# EAGLE design PlytaGlowna (EAGLE 8.6.0)
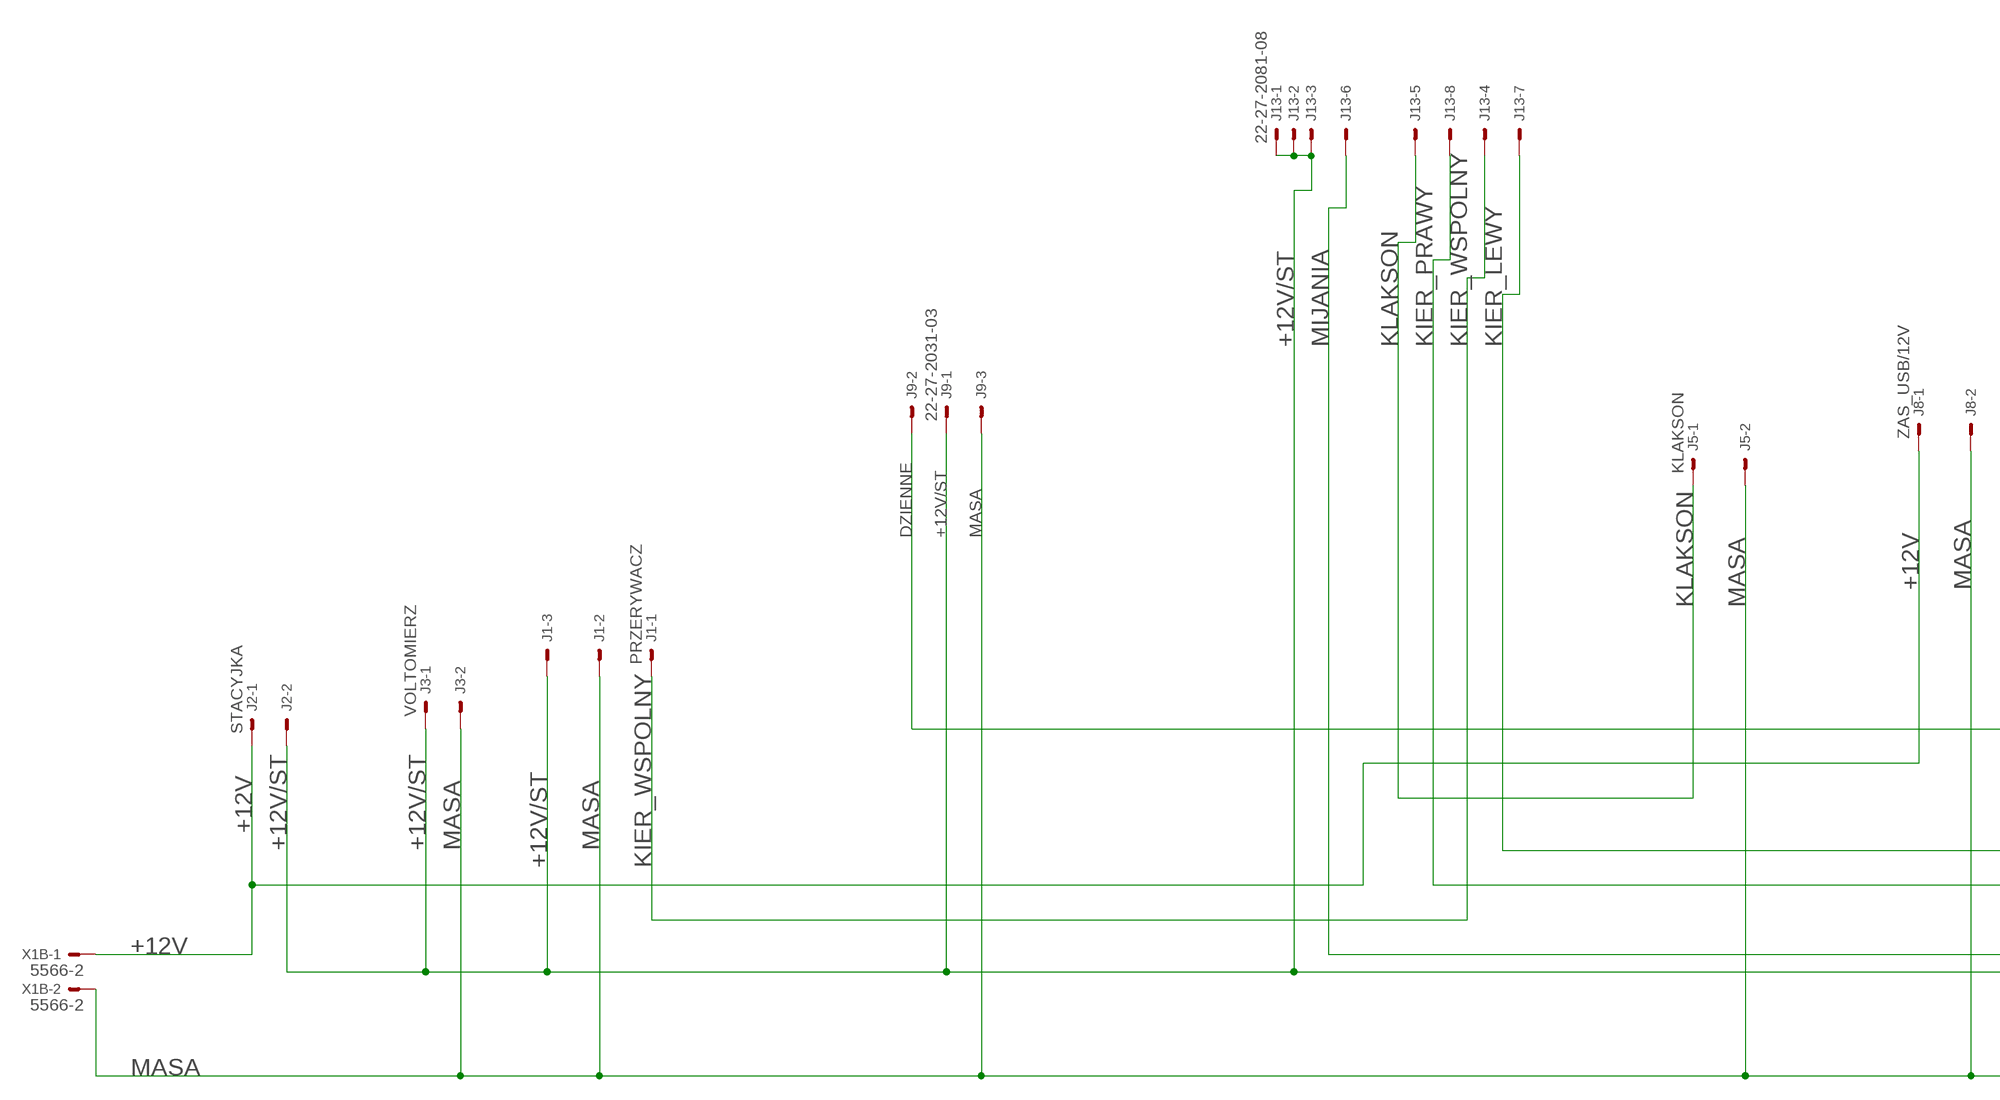
[diagram p0: schematic, sheet 1, part 1 of 2]
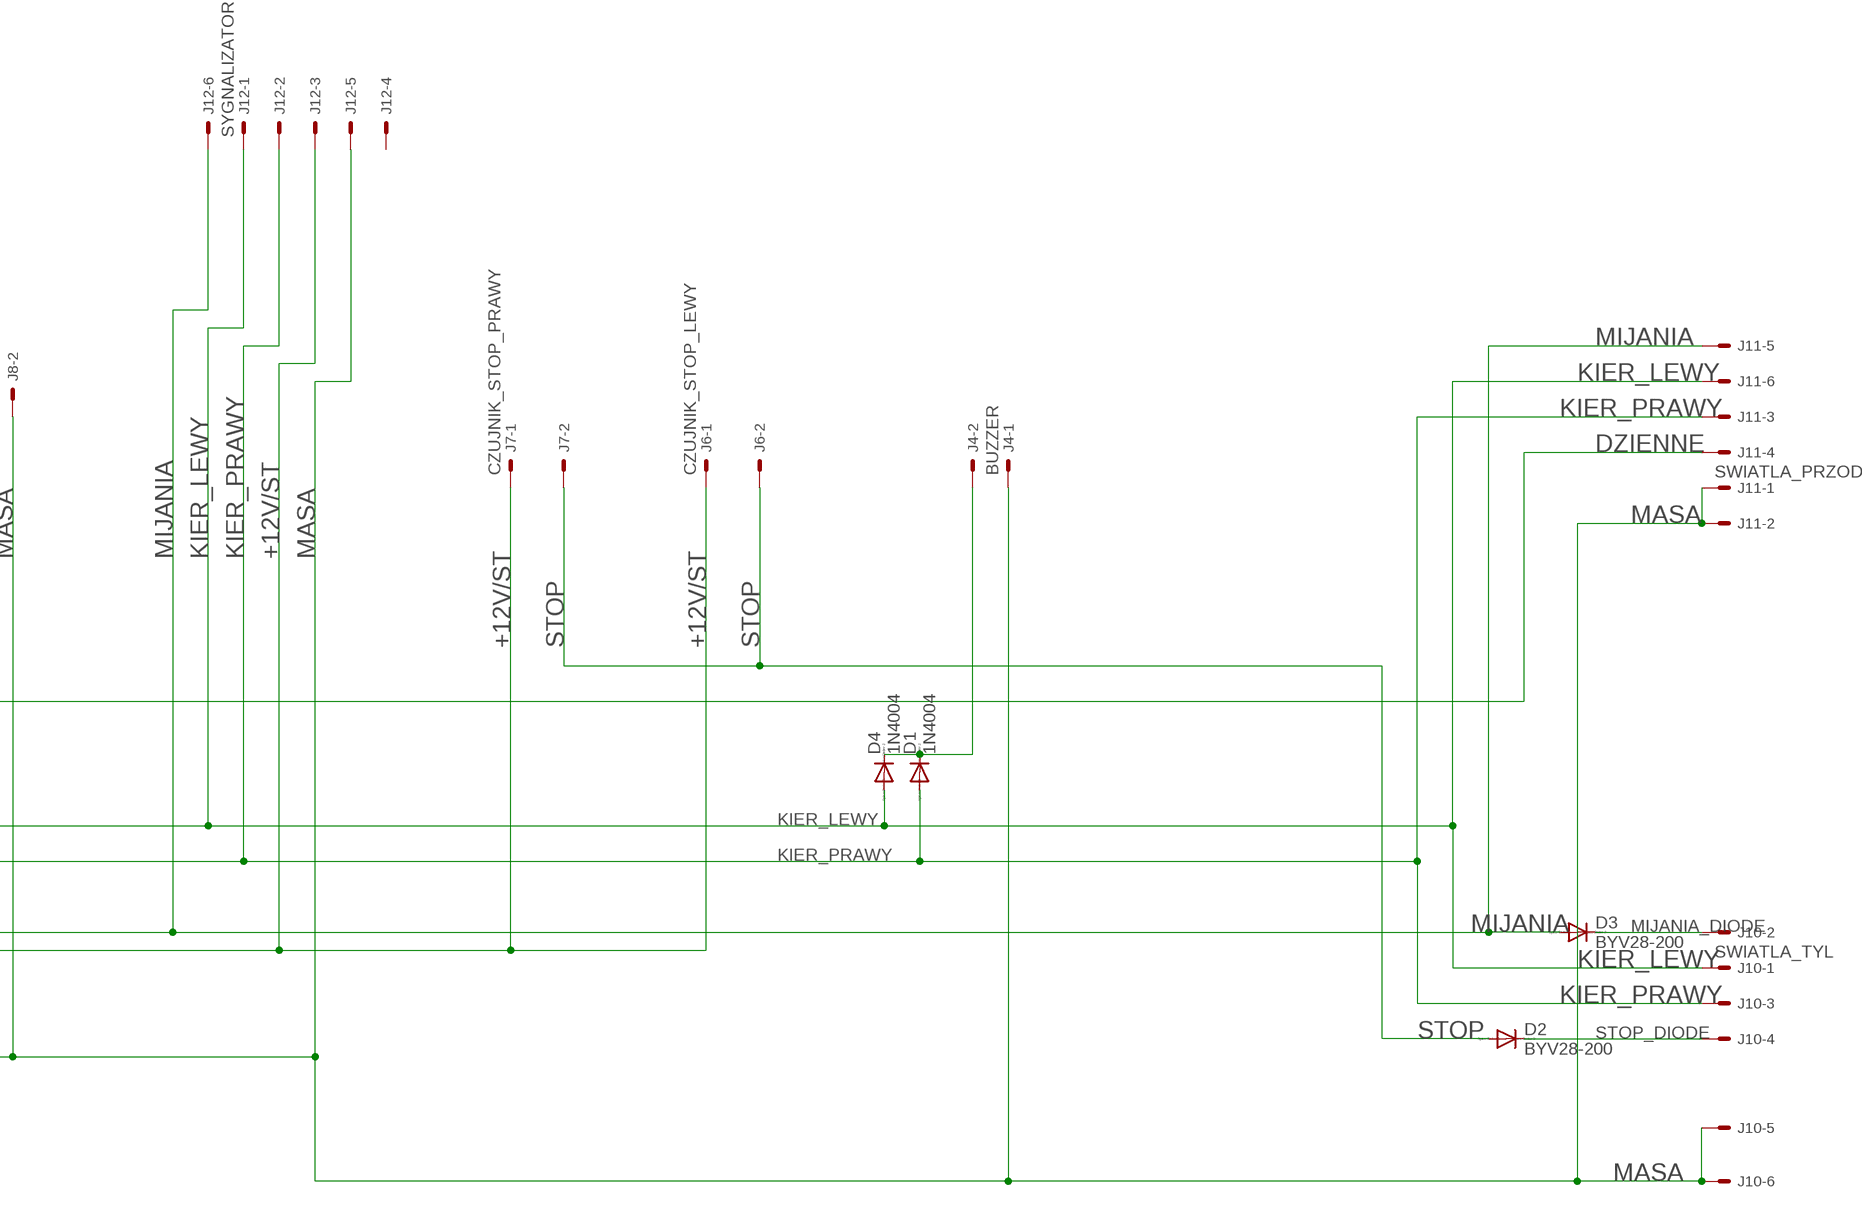
[diagram p1: schematic, sheet 1, part 2 of 2]

## Parts
D1  1N4004  [DO41-10]
D2  BYV28-200  BYV28  [SOD64-10]
D3  BYV28-200  BYV28  [SOD64-10]
D4  1N4004  [DO41-10]
J1  PRZERYWACZ  22-27-2031-03  [6410-03]
J2  STACYJKA  22-27-2021-02  [6410-02]
J3  VOLTOMIERZ  22-27-2021-02  [6410-02]
J4  BUZZER  22-27-2021-02  [6410-02]
J5  KLAKSON  22-27-2021-02  [6410-02]
J6  CZUJNIK_STOP_LEWY  22-27-2021-02  [6410-02]
J7  CZUJNIK_STOP_PRAWY  22-27-2021-02  [6410-02]
J8  ZAS_USB/12V  22-27-2021-02  [6410-02]
J9  22-27-2031-03  [6410-03]
J10  SWIATLA_TYL  22-27-2061-06  [6410-06]
J11  SWIATLA_PRZOD  22-27-2061-06  [6410-06]
J12  SYGNALIZATOR  22-27-2061-06  [6410-06]
J13  22-27-2081-08  [6410-08]
X1B  5566-2  [5566-2]

## Nets
+12V: J2.1 J8.1 X1B.1
+12V/ST: J1.3 J2.2 J3.1 J6.1 J7.1 J9.1 J12.3 J13.1 J13.2 J13.3
DZIENNE: J9.2 J11.4
KIER_LEWY: D4.A J10.1 J11.6 J12.1 J13.7
KIER_PRAWY: D1.A J10.3 J11.3 J12.2 J13.8
KIER_WSPOLNY: J1.1 J13.4
KLAKSON: J5.1 J13.5
MASA: J1.2 J3.2 J4.1 J5.2 J8.2 J9.3 J10.5 J10.6 J11.1 J11.2 J12.5 X1B.2
MIJANIA: D3.A J11.5 J12.6 J13.6
MIJANIA_DIODE: D3.C J10.2
N$1: D1.C D4.C J4.2
STOP: D2.A J6.2 J7.2
STOP_DIODE: D2.C J10.4
Unconnected: J12.4

## Library data of the parts
D1 D4 = diode:1N4004: DIODE general purpose rectifier, 1 A
D2 D3 = diode:BYV28: DIODE ultra fast
J1 J9 = con-molex:22-?-03: CONNECTOR wire to board 2.54 mm (.1 inch) pitch header; MF: MOLEX; OC_FARNELL: unknown; OC_NEWARK: unknown
J2-J8 = con-molex:22-?-02: CONNECTOR wire to board 2.54 mm (.1 inch) pitch header; MF: MOLEX; OC_FARNELL: unknown; OC_NEWARK: unknown
J10-J12 = con-molex:22-?-06: CONNECTOR wire to board 2.54 mm (.1 inch) pitch header; MF: MOLEX; OC_FARNELL: unknown; OC_NEWARK: unknown
J13 = con-molex:22-?-08: CONNECTOR wire to board 2.54 mm (.1 inch) pitch header; MF: MOLEX; OC_FARNELL: unknown; OC_NEWARK: unknown
X1B = con-molex:5566-2: Mini FIT connector 2 pol Source: http://www.molex.com; OC_FARNELL: 1822072; OC_NEWARK: unknown

## Board
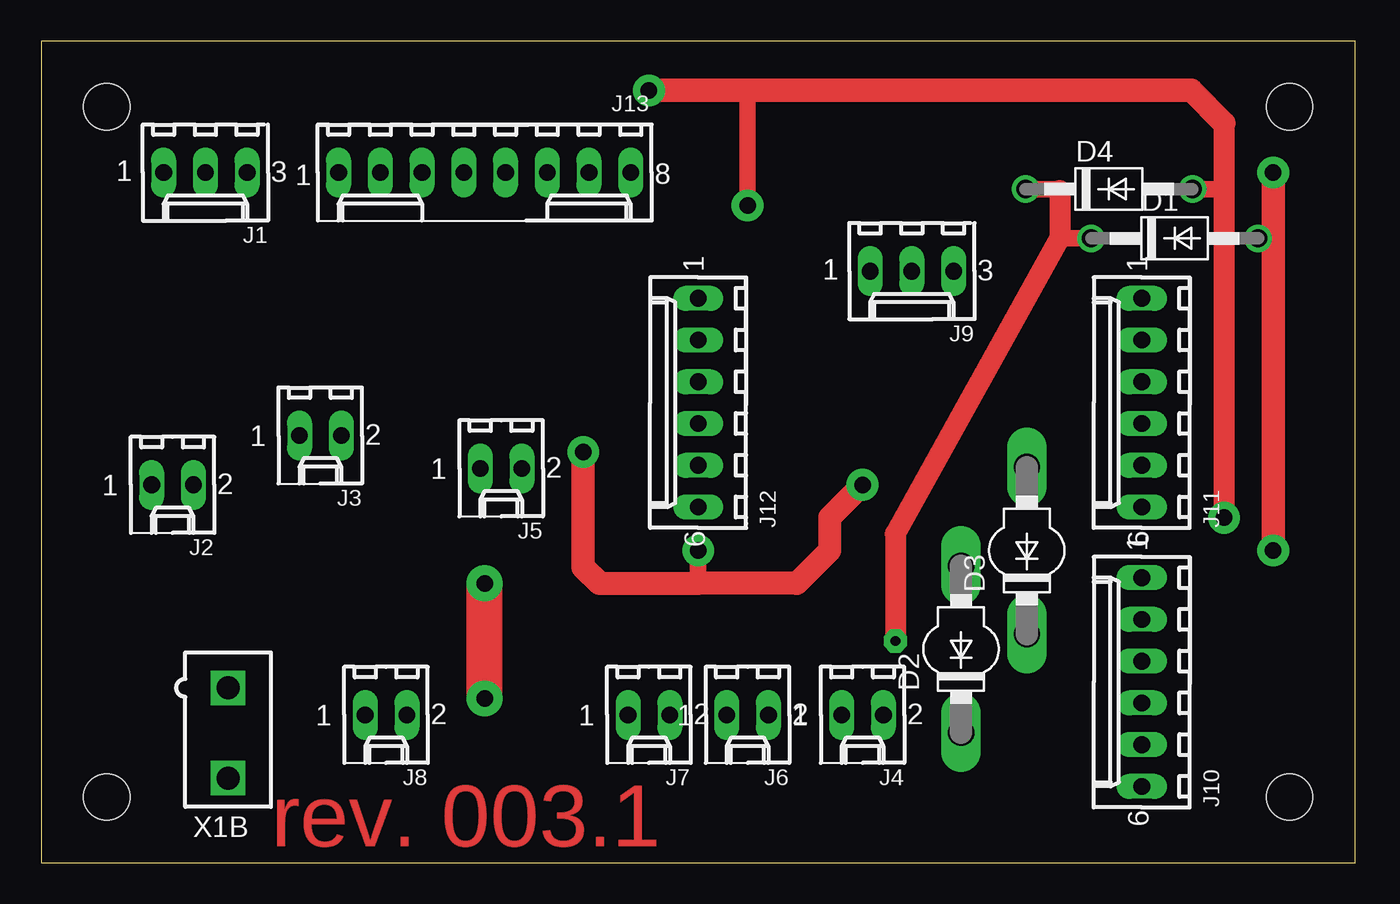
[diagram p2: board, top side]
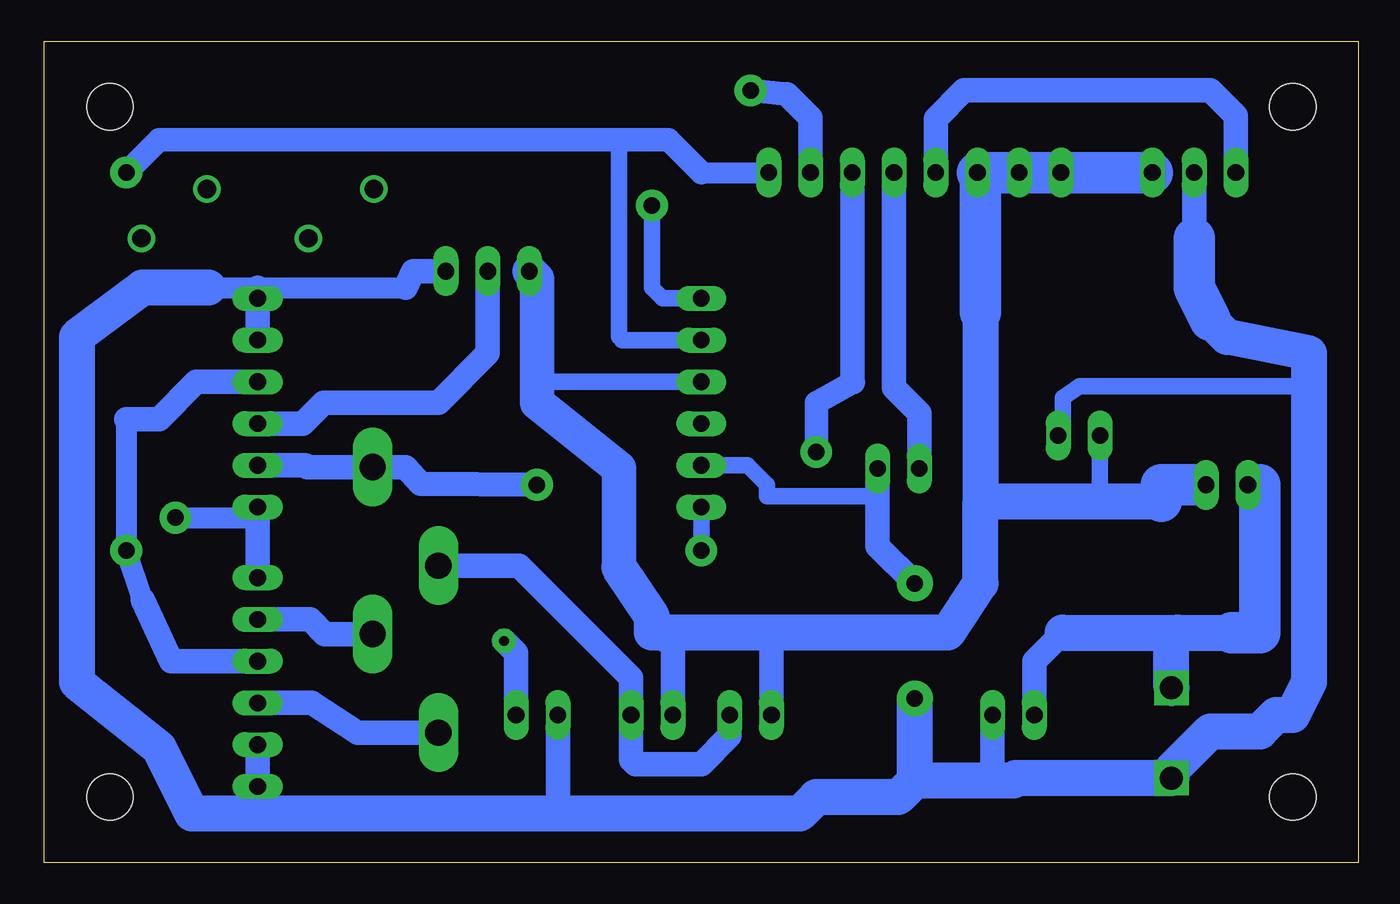
[diagram p3: board, bottom side, seen from below]

Size 80 x 50 mm. Coordinates in mm from the lower left corner, seen from the top.
Outline: 0,0 80,0 80,50 0,50 0,0
Copper layers (1*16): Top 0.035mm / dielectric 1.5mm / Bottom 0.035mm
Design rules "default": minimum track width 10mil, minimum drill 24mil, track to track 8mil, track to pad 8mil, pad to pad 8mil, via to via 8mil, smd to smd 8mil, copper to edge 40mil, drill to drill 8mil, minimum pad ring 10mil, minimum via ring 8mil, stop-mask expansion 4mil, vias tented up to drill 0mil, thermal gap 10mil
Holes 2.8 mm at 76,46 76,4 4,46 4,4

### Footprints (pad centres in the part's own frame; a part is rotated, then mirrored left to right if it is on the bottom)
DO41-10 = drill 1.118: A 5.08,0; C -5.08,0
SOD64-10 = drill 1.6 long: A 5.08,0; C -5.08,0
6410-03 = drill 1.016 long: 1 2.54,0; 2 0,0; 3 -2.54,0
6410-02 = drill 1.016 long: 1 1.27,0; 2 -1.27,0
6410-06 = drill 1.016 long: 1 6.35,0; 2 3.81,0; 3 1.27,0; 4 -1.27,0; 5 -3.81,0; 6 -6.35,0
6410-08 = drill 1.016 long: 1 8.89,0; 2 6.35,0; 3 3.81,0; 4 1.27,0; 5 -1.27,0; 6 -3.81,0; 7 -6.35,0; 8 -8.89,0
5566-2 = drill 1.4 square: 1 0,-2.75; 2 0,2.75

### Placement (x,y rotation side)
D1  69,38 0 top
D2  56,13 90 top
D3  60,19 90 top
D4  65,41 0 top
J1  10,42 180 top
J2  8,23 180 top
J3  17,26 180 top
J4  50,9 180 top
J5  28,24 180 top
J6  43,9 180 top
J7  37,9 180 top
J8  21,9 180 top
J9  53,36 180 top
J10  67,11 90 top
J11  67,28 90 top
J12  40,28 90 top
J13  27,42 180 top
X1B  11.38,7.9 180 top

### Tracks (layer width: path | path; a pad name or v marks a point on that pad's centre or on a via)
+12V
  Bottom 1.016: 6,23 J2.1
  Bottom 1.5: J8.1 19.73,12.27 18,14
  Bottom 2.184: 18,14 11,14 | 11,14 7.7,14 | X1B.1 11.38,13.62 11,14
  Bottom 2.54: 7.7,14 6,14 6,23
+12V/ST
  Bottom 0.508: 49.73,29.27 50,29
  Bottom 1.016: 10,23 J2.2 | J3.1 15.73,22 16,22 | J12.3 49.73,29.27
  Bottom 1.5: J7.1 35.73,13.73 36,14 | J6.1 41.73,13.27 43,14
  Bottom 2.1: 45,18 45,24 50,28 50,29 50,35.54 J9.1
  Bottom 2.184: 23,22 16,22 12,22 | 23,33.5 23,22 | 23,22 23,17 25,14 36,14 43,14 43,15 45,18
  Bottom 2.54: 12,22 12,23 10,23 | 23,33.5 23,41.81 J13.3 J13.2 J13.1 J1.3
DZIENNE
  Bottom 1.5: J9.2 53,31 56,28 63,28 64.27,26.73 J11.4
KIER_LEWY  (via drill 1 pad 1.93)
  Top 1.016: v43,40 43,47 | D4.A 72,41
  Top 1.27: 72,45 72,41 v72,21
  Top 1.422: v37,47 43,47 70,47 72,45
  Bottom 1.016: J12.1 42.35,34.35 43,35 v43,40
  Bottom 1.27: v72,21 67,21
  Bottom 1.422: v37,47 34.77,46.77
  Bottom 1.5: J10.1 67,21 J11.6 | 34.77,46.77 33.35,45.35 J13.7
KIER_PRAWY  (via drill 1 pad 1.93)
  Top 1.016: D1.A 75,38
  Top 1.422: v75,42 75,38 v75,19
  Bottom 0.508: 44.81,31.81 45,32
  Bottom 1.016: 45,32 45,44 | J12.2 44.81,31.81
  Bottom 1.27: 74,16 v75,19 75,27 | 40,42 J13.8
  Bottom 1.422: v75,42 73,44 45,44 42,44 40,42
  Bottom 1.5: J10.3 72.27,12.27 74,16 | J11.3 70.73,29.27 73,27 75,27
KIER_WSPOLNY
  Bottom 1.5: J1.1 7.46,45.46 9,47 24,47 25.73,45.27 J13.4
KLAKSON
  Bottom 1.5: J5.1 26.73,27.36 28.27,28.9 J13.5
MASA  (via drill 1 pad 2.18)
  Top 2.184: v27,10 v27,17
  Bottom 0.508: 29.57,22.3 29.27,22
  Bottom 1.016: 3,29 17,29 18,28.3 18,26 J3.2 | 29.57,22.3 36,22.3 36,23 37.19,24.19 J12.5
  Bottom 1.27: 70,35 67,35 58,35
  Bottom 1.5: J4.1 48.73,3 | J5.2 29.27,22 29.27,19.27 v27,17 | J8.2 22.27,5.27 22,5 | 58,35 57.54,36 J9.3 | J10.5 J10.6 67,3 | J11.2 J11.1 67,35 | J1.2 10,38
  Bottom 2.184: 9,33 8,32 3,31 3,29 3,11 4,9 5,9 6,8 9,8 11.38,5.62 X1B.2 20.85,5.15 21,5 22,5 27,5 | 27,5 v27,10 | 27,5 28,4 33,4 34,3 48.73,3 67,3 71,3 73,7 78,11 78,32 74,35 70,35
  Bottom 2.54: 10,38 10,35 9,33
MIJANIA  (via drill 1 pad 1.93)
  Top 1.016: 40,17 v40,19
  Top 1.4: 34,17 40,17 46,17 48,19 48,21 v50,23
  Top 1.422: v33,25 33,18 34,17
  Bottom 0.406: 40,20 v40,19
  Bottom 1.016: J12.6 v40,19
  Bottom 1.422: 30.77,29.23 33,28 v33,25
  Bottom 1.5: J13.6 30.81,29.27 30.77,29.23 | J11.5 64.11,24.19 64,24.08 D3.A 58,24.08 57.08,23.08 v50,23
MIJANIA_DIODE
  Bottom 1.5: J10.2 63.81,14.81 62.92,13.92 D3.C
N$1  (via drill 0.6 pad 1.42)
  Top 1.016: D4.C 61.92,41 62,40.92 | D1.C 62,38
  Top 1.27: 62,40.92 62,38 52,20 v52,13.5
  Bottom 1.5: J4.2 51.27,12.77 v52,13.5
STOP
  Bottom 1.5: J7.2 38.27,7.73 40,6 44,6 44.27,6.27 J6.2 44.27,11.27 51.08,18.08 D2.A
STOP_DIODE
  Bottom 1.5: J10.4 63.73,9.73 60.92,7.92 D2.C

### Text on the board
Top: rev. 003.1